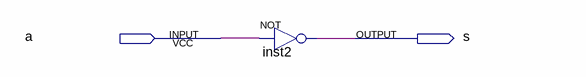
[diagram p0: schematic sheet]
// Quartus schematic primeiro.bdf as structural Verilog: 1 symbols, 2 pins
module primeiro (
  input  a,
  output s
);

  not inst2 (s, a);
endmodule
